# EasyEDA Pro project MIoTEvBoard_A.epro, board PCB
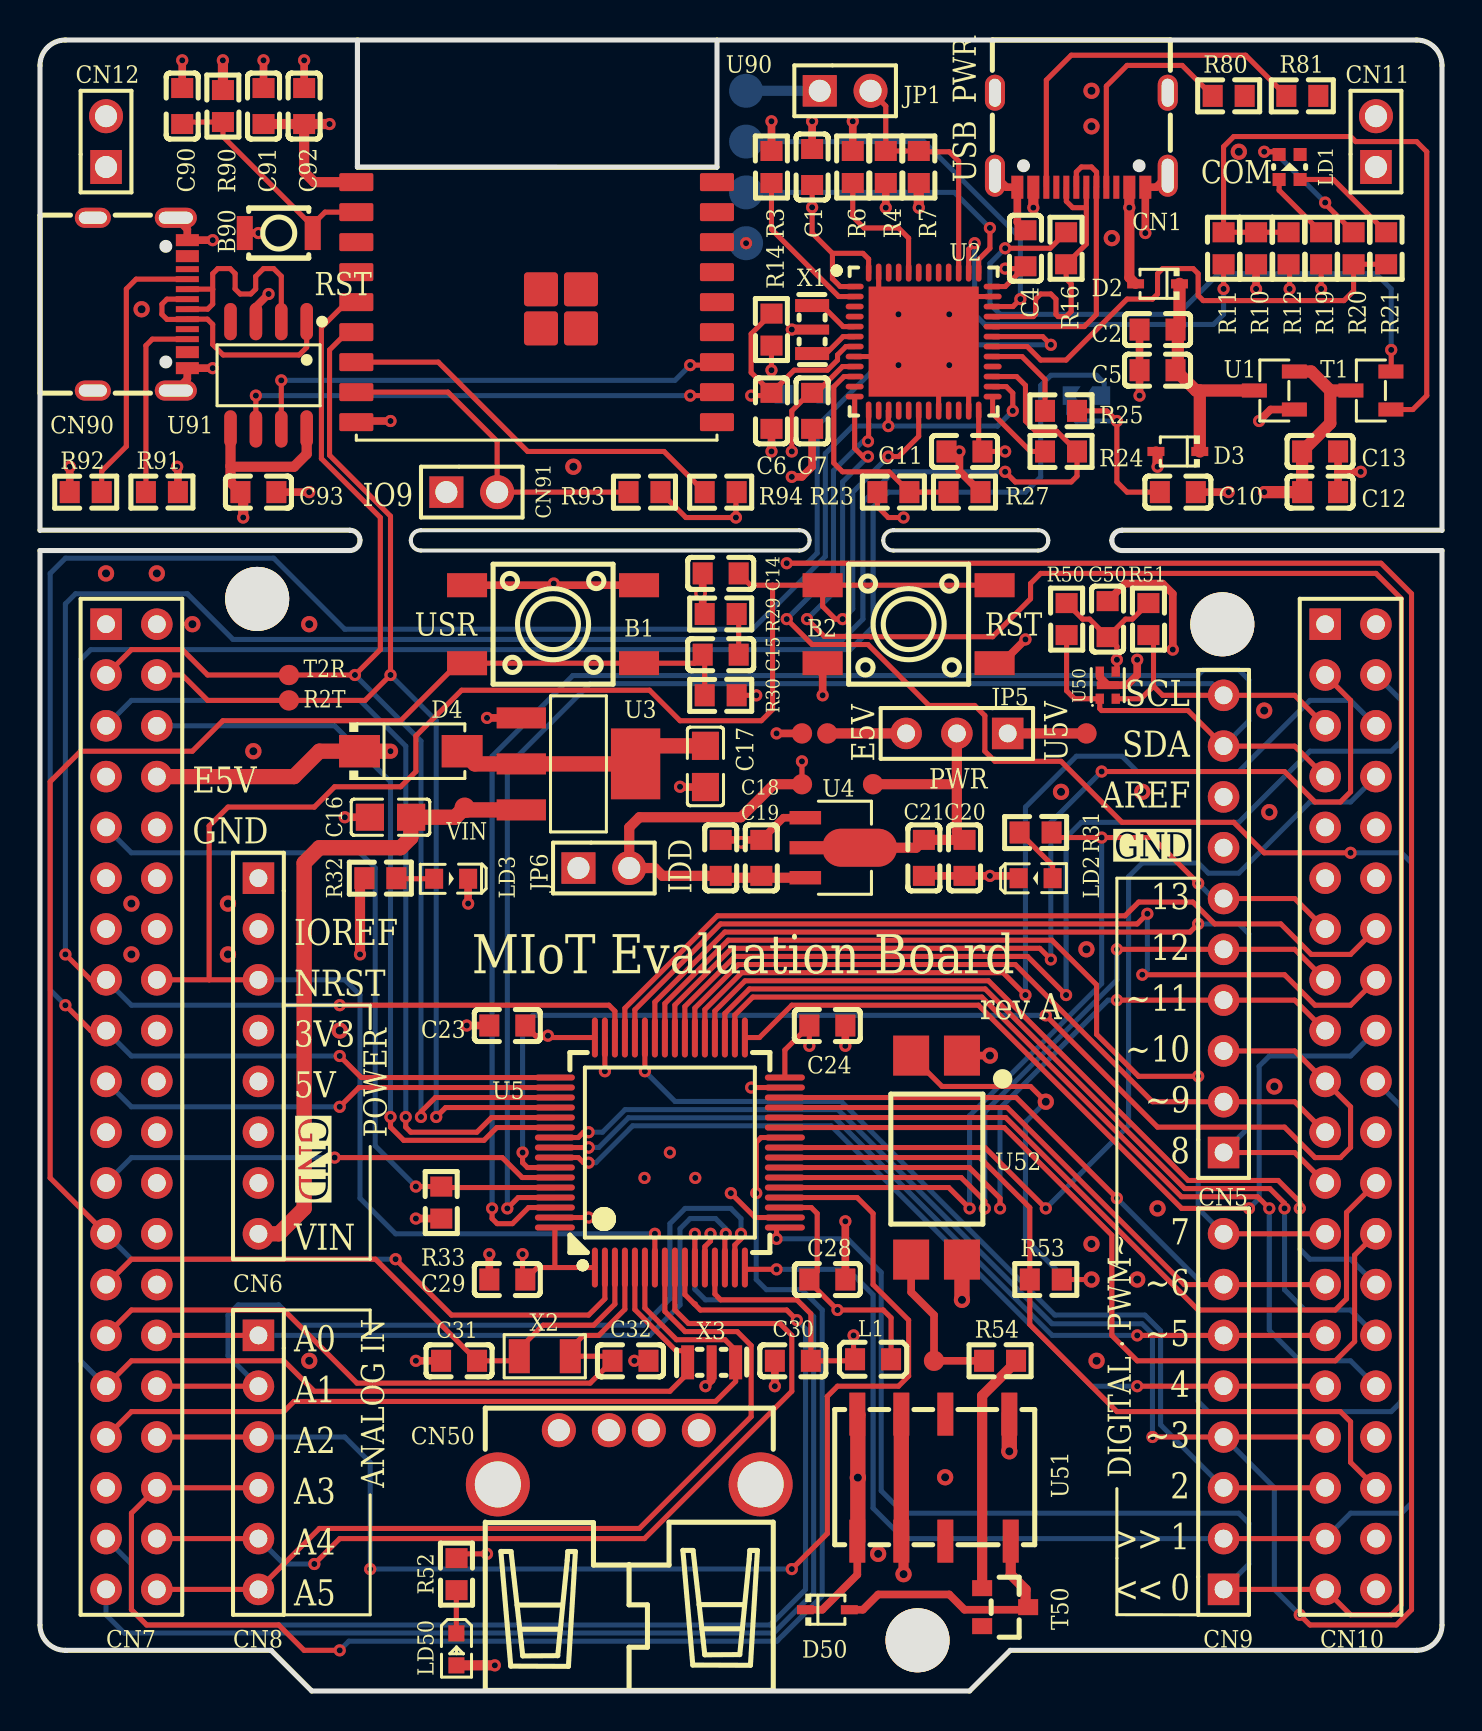
[diagram p5: board, top side]
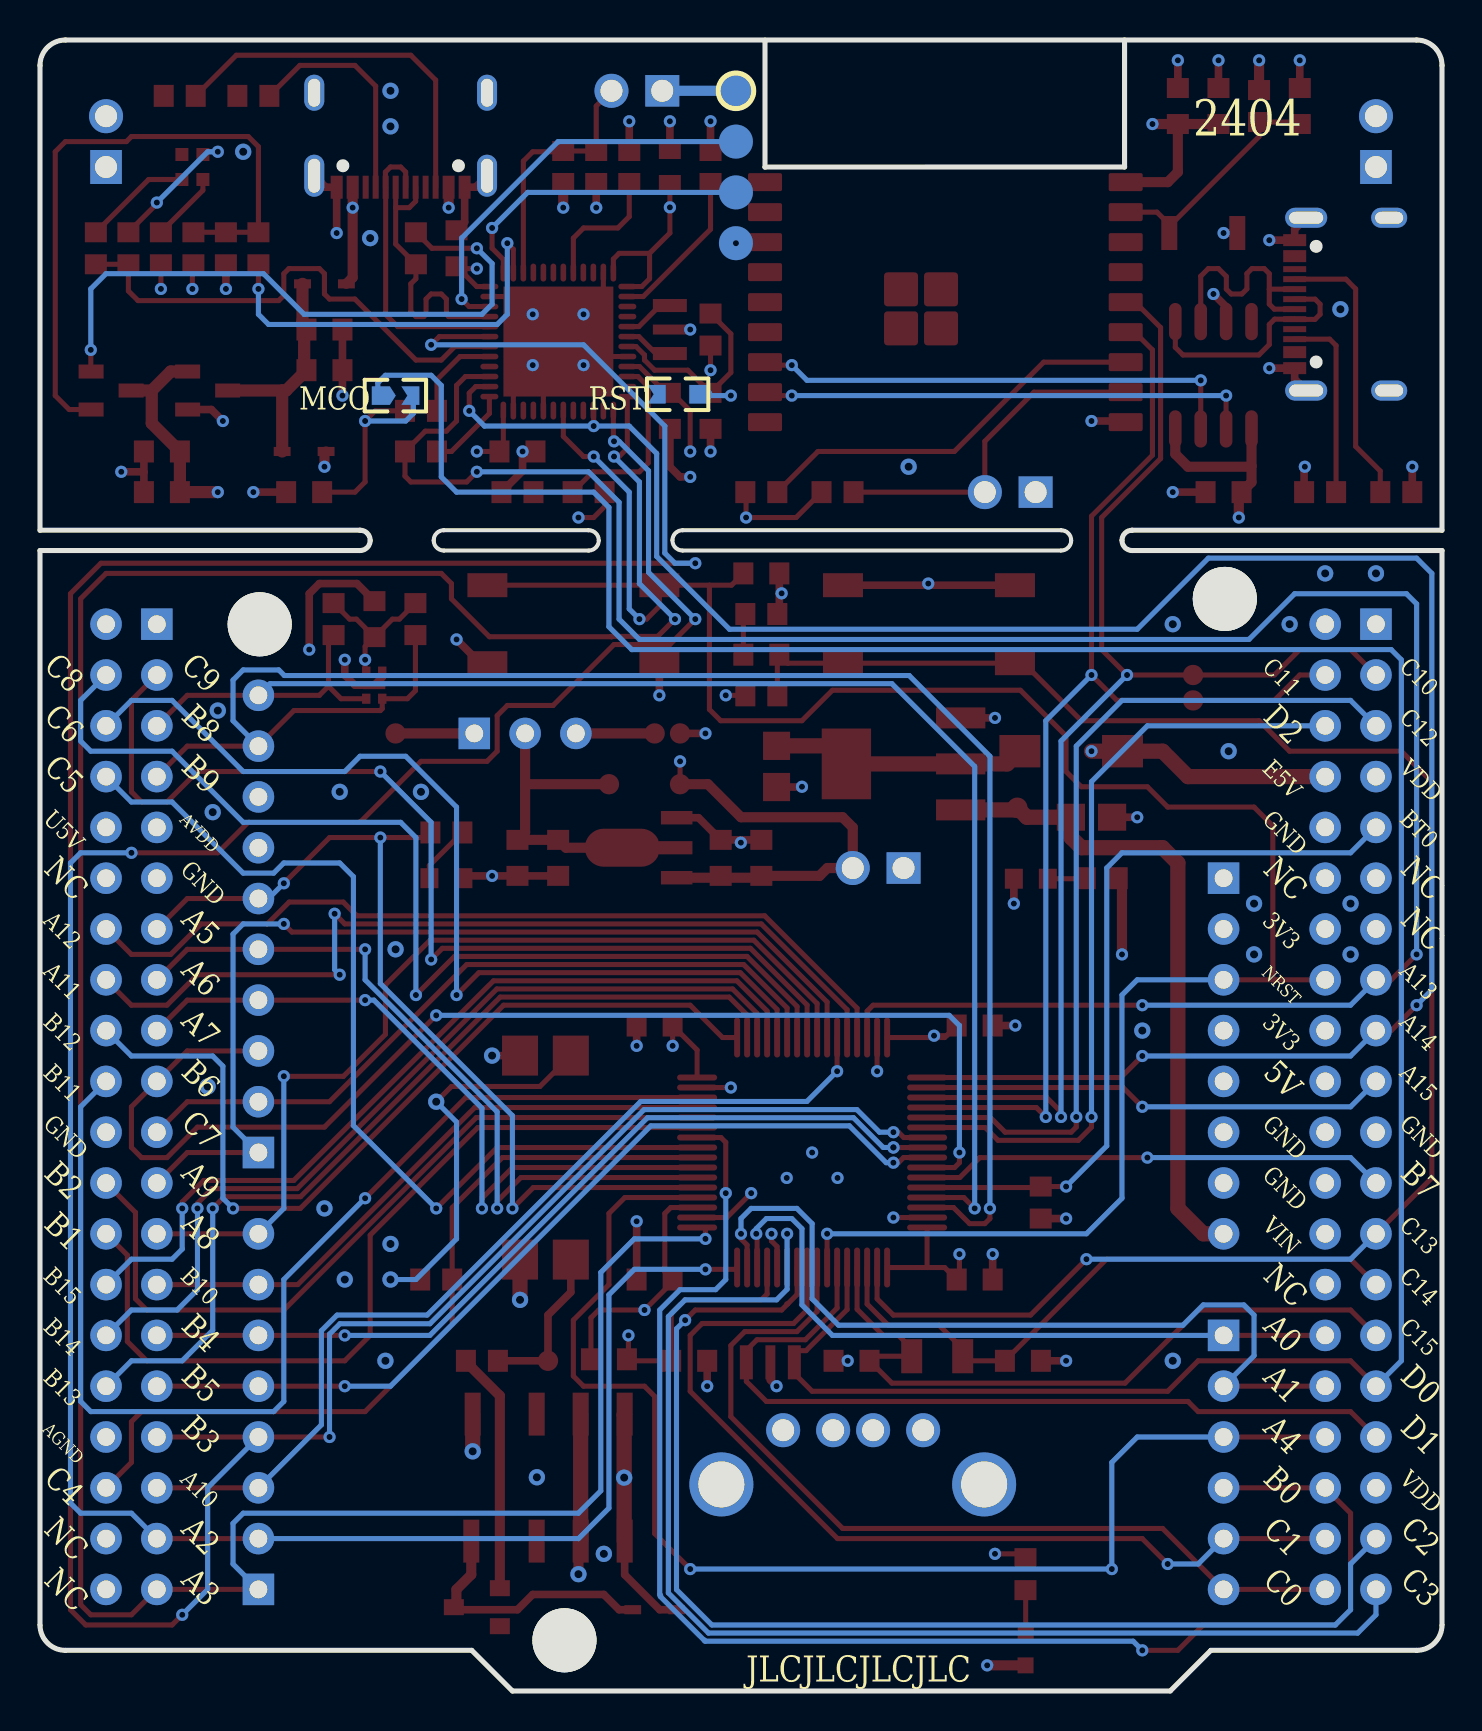
[diagram p6: board, bottom side, seen from below]

Outline 70.1 x 82.55 mm; copper layers: Top Layer, Inner1, Inner2, Bottom Layer. Coordinates in mm from the lower left corner of the outline.
Outline path: 15.87,82.55 15.87,76.2 33.85,76.2 33.85,82.55 ; 0,81.28 0,58.04 15.49,58.04 arc(15.85,57.89) 16,57.53 arc(15.85,57.17) 15.49,57.02 0,57.02 0,3.3 arc(0.37,2.4) 1.27,2.03 11.56,2.03 13.59,0 46.48,0 48.51,2.03 68.83,2.03 arc(69.73,2.4) 70.1,3.3 70.1,57.02 54.1,57.02 arc(53.74,57.17) 53.59,57.53 arc(53.74,57.89) 54.1,58.04 70.1,58.04 70.1,81.28 arc(69.73,82.18) 68.83,82.55 1.27,82.55 arc(0.37,82.18) 0,81.28 ; 18.54,57.53 arc(18.69,57.89) 19.05,58.04 37.97,58.04 arc(38.33,57.89) 38.48,57.53 arc(38.33,57.17) 37.97,57.02 19.05,57.02 arc(18.69,57.17) 18.54,57.53 ; 42.16,57.53 arc(42.31,57.89) 42.67,58.04 49.91,58.04 arc(50.27,57.89) 50.42,57.53 arc(50.27,57.17) 49.91,57.02 42.67,57.02 arc(42.31,57.17) 42.16,57.53
Stack: Top Layer 0.035mm 外层铜厚1oz / Dielectric1 0.2104mm 7628 RC49% 8.6mil / Inner1 0.0152mm 内层铜厚 / Dielectric2 1.065mm 1.1mm H/HOZ 含铜 / Inner2 0.0152mm 内层铜厚 / Dielectric3 0.2104mm 7628 RC49% 8.6mil / Bottom Layer 0.035mm 外层铜厚1oz

## Design rules (mm)
spacing Default (default): track to track 0.152, other pairs 0 to 0.152
track width Default (default): min 0.152, default 0.152, max 25.4
differential pair differentialPair (default): width min 0.127, default 0.254, max 2.54; gap min 0.152, default 0.152
via Default (default): diameter min 0.61, default 0.61, max 100.025; hole min 0.305, default 0.305, max 59.995

## Placement (name value [footprint] x y rotation side)
B1  USER  [KEY-SMD_4P-L6.0-W6.0-P3.90-LS9.0]  25.65 53.34 0 top
B2  RESET  [KEY-SMD_4P-L6.0-W6.0-P3.90-LS9.0]  43.43 53.34 180 top
B90  B3U-1000P  [KEY-SMD_B3U-1000PM]  11.94 72.9 0 top
C1  100nF  [C0603]  38.61 76.2 270 top
C2  1uF  [C0603]  55.88 68.07 0 top
C4  100nF  [C0603]  49.28 72.14 270 top
C5  100nF  [C0603]  55.88 66.04 0 top
C6  100nF  [C0603]  36.58 64.01 90 top
C7  100nF  [C0603]  38.61 64.01 90 top
C10  20pF  [C0603]  56.9 59.94 180 top
C11  100nF  [C0603]  46.23 61.98 0 top
C12  100nF  [C0603]  64.01 59.94 180 top
C13  1uF  [C0603]  64.01 61.98 180 top
C14  100nF  [C0603]  34.04 55.88 0 top
C15  100nF  [C0603]  34.04 51.82 180 top
C16  10uF  [C0805]  17.53 43.69 0 top
C17  10uF  [C0805]  33.27 46.23 90 top
C18  1uF  [C0603]  34.04 41.66 90 top
C19  100nF  [C0603]  36.07 41.66 90 top
C20  100nF  [C0603]  46.23 41.66 270 top
C21  1uF  [C0603]  44.2 41.66 270 top
C23  100nF  [C0603]  23.37 33.27 180 top
C24  100nF  [C0603]  39.37 33.27 0 top
C28  100nF  [C0603]  39.37 20.57 0 top
C29  1uF  [C0603]  23.37 20.57 0 top
C30  100nF  [C0603]  37.64 16.51 180 top
C31  10pF  [C0603]  20.95 16.51 180 top
C32  10pF  [C0603]  29.52 16.51 0 top
C50  100nF  [C0603]  53.38 53.59 270 top
C90  1uF  [C0603]  7.11 79.25 90 top
C91  100nF  [C0603]  11.18 79.25 270 top
C92  1uF  [C0603]  13.21 79.25 90 top
C93  100nF  [C0603]  10.92 59.94 180 top
CN0  SWD  [烧录点4P-2.54MM]  35.31 80.01 270 bottom
CN1  TYPE-C16PIN  [USB-C-SMD_TYPE-C16PIN]  52.07 77.55 180 top
CN5  HDR-F-2.54_1x10  [HDR-F-2.54_1X10]  59.18 38.35 90 top
CN6  HDR-F-2.54_1x8  [HDR-F-2.54_1X8]  10.92 33.02 270 top
CN7  HDR-M-2.54_2x20  [HDR-M-2.54_2X20]  4.57 29.21 270 top
CN8  HDR-F-2.54_1x6  [HDR-F-2.54_1X6]  10.92 12.7 270 top
CN9  HDR-F-2.54_1x8  [HDR-F-2.54_1X8]  59.18 12.7 90 top
CN10  HDR-M-2.54_2x20  [HDR-M-2.54_2X20]  65.53 29.21 270 top
CN11  HDR-M-2.54_1x2  [HDR-M-2.54_1X2]  66.8 77.47 90 top
CN12  HDR-M-2.54_1x2  [HDR-M-2.54_1X2]  3.3 77.47 90 top
CN50  AF 90° WJDG  [USB-A-TH_AF-WJDG]  29.46 11.68 0 top
CN90  TYPE-C16PIN  [USB-C-SMD_TYPE-C16PIN]  5 69.34 270 top
CN91  HDR-M-2.54_1x2  [HDR-M-2.54_1X2]  21.59 59.94 0 top
D2  BAT60JFILM  [SOD-323_L1.8-W1.3-LS2.5-RD]  55.88 70.36 180 top
D3  BAT60JFILM  [SOD-323_L1.8-W1.3-LS2.5-RD]  56.9 61.98 180 top
D4  STPS2L30A  [SMA_L4.4-W2.8-LS5.4-RD]  18.54 46.99 0 top
D50  BAT60JFILM  [SOD-323_L1.8-W1.3-LS2.5-RD]  39.37 4.06 0 top
JP1  HDR-M-2.54_1x2  [HDR-M-2.54_1X2]  40.26 80.01 0 top
JP5  HDR-M-2.54_1x3  [HDR-M-2.54_1X3]  45.85 47.88 180 top
JP6  HDR-M-2.54_1x2  [HDR-M-2.54_1X2]  28.19 41.15 0 top
L1  Bead  [L0603]  41.66 16.59 180 top
LD1  MHT194CRCGCT  [LED-ARRAY-SMD_4P-0605-L1.60-W1.50-BL]  62.48 76.2 270 top
LD2  GREEN  [LED0603_GREEN]  49.78 40.64 180 top
LD3  RED  [LED0603_RED]  20.56 40.61 0 top
LD50  -  [LED_0603]  20.83 2.03 270 top
NOREF  -  [Pad_ie4139]  59.12 53.34 90 top
NOREF#2  -  [Pad_ie4140]  43.88 2.53 90 top
NOREF#3  -  [Pad_ie4141]  10.86 54.61 90 top
R3  10K  [R0603]  36.58 76.2 90 top
R4  4K7  [R0603]  42.29 76.2 270 top
R6  100K  [R0603]  40.64 76.2 90 top
R7  2K7  [R0603]  43.94 76.2 270 top
R10  36K  [R0603]  60.81 72.14 90 top
R11  100R  [R0603]  59.18 72.14 90 top
R12  10K  [R0603]  62.43 72.14 270 top
R14  100K  [R0603]  36.58 68.07 90 top
R16  1K5  [R0603]  51.31 72.14 90 top
R19  0  [R0603]  64.06 72.14 270 top
R20  200R  [R0603]  65.68 72.14 90 top
R21  200R  [R0603]  67.31 72.14 90 top
R23  4K7  [R0603]  42.67 59.94 0 top
R24  100R  [R0603]  51.05 61.98 0 top
R25  100R  [R0603]  51.05 64.01 0 top
R27  4K7  [R0603]  46.23 59.94 180 top
R29  100R  [R0603]  34.04 53.85 0 top
R30  4K7  [R0603]  34.04 49.78 180 top
R31  510R  [R0603]  49.78 42.93 180 top
R32  1K  [R0603]  17.02 40.64 0 top
R33  10K  [R0603]  20.07 24.42 90 top
R50  4K7  [R0603]  51.33 53.59 270 top
R51  4K7  [R0603]  55.42 53.59 270 top
R52  10K  [R0603]  20.83 5.84 90 top
R53  1K  [R0603]  50.29 20.57 0 top
R54  1K  [R0603]  48.01 16.51 0 top
R80  5K1  [R0603]  59.44 79.76 0 top
R81  5K1  [R0603]  63.12 79.76 0 top
R90  10K  [R0603]  9.15 79.25 90 top
R91  5K1  [R0603]  6.1 59.94 0 top
R92  5K1  [R0603]  2.29 59.94 180 top
R93  10K  [R0603]  30.23 59.94 180 top
R94  10K  [R0603]  34.04 59.94 180 top
SB11  ShortPad  [SOLDERJUMPER_2_OPEN_0603]  38.23 64.84 90 bottom
SB16  ShortPad  [SOLDERJUMPER_2_OPEN_0603]  52.32 64.77 270 bottom
T1  S9013  [SOT-23-3_L2.9-W1.3-P1.90-LS2.4-BR]  66.55 65.02 0 top
T50  -  [S8050_SOT-23]  48.26 4.32 180 top
TP1  -  [TP-Round-1.0]  12.45 49.53 0 top
TP2  -  [TP-Round-1.0]  12.45 50.8 0 top
TP3  -  [TP-Round-1.0]  44.7 16.51 0 top
TP4  -  [TP-Round-1.0]  21.24 44.17 0 top
TP5  -  [TP-Round-1.0]  39.37 47.88 0 top
TP6  -  [TP-Round-1.0]  52.32 47.88 0 top
TP7  -  [TP-Round-1.0]  41.66 45.34 0 top
TP8  -  [TP-Round-1.0]  38.1 45.34 0 top
TP9  -  [TP-Round-1.0]  38.1 47.88 0 top
U1  XC6206  [SOT-23-3_L2.9-W1.3-P1.90-LS2.4-BR]  61.72 65.02 0 top
U2  STM32F103CBU6  [UFQFPN-48_L7.0-W7.0-P0.50-BL-EP]  44.19 67.47 270 top
U3  AMS1117-5.0  [SOT-223_L6.5-W3.5-P2.30-LS7.0-BR]  26.92 46.36 180 top
U4  HT7333-A  [SOT-89-3_L4.5-W2.5-P1.50-LS4.2-BR]  39.62 42.16 180 top
U5  STM32F103RxTx  [LQFP-64_L10.0-W10.0-P0.50-LS12.0-BL]  31.5 26.92 0 top
U50  SHT40-AD1B-R2  [DFN-4_L1.5-W1.5-P0.8-TL-EP]  53.39 50.29 90 top
U51  HFD4/5-SR  [RELAY-SMD_HFD4-5-SR]  44.7 10.67 180 top
U52  GX817C-S  [SOP-4_L6.5-W4.6-P2.54-LS10.2-TR]  44.83 26.67 0 top
U90  -  [MHCWB6G-B]  25.15 69.39 0 top
U91  CH340N  [SOP-8_L4.9-W3.9-P1.27-LS6.0-BL]  11.43 65.79 180 top
X1  8MHz  [OSC-SMD_3P-L3.2-W1.3-P1.2-L]  38.61 68.07 90 top
X2  32768  [OSC-SMD_L3.2-W1.5]  25.24 16.74 180 top
X3  8MHz  [OSC-SMD_3P-L3.2-W1.3-P1.2-L]  33.58 16.43 180 top

## Footprints (pads in the part's own frame, mm; a bottom-side part is the same pattern mirrored in y, then rotated)
C0603
  rect 1x1.1 smd: 1(-0.9,0) 2(0.9,0)
C0805
  rect 1.41x1.35 smd: 1(-1.03,0) 2(1.03,0)
DFN-4_L1.5-W1.5-P0.8-TL-EP
  rect 0.505x0.42 smd: 1(-0.677,0.4) 2(-0.677,-0.4) 3(0.677,-0.4) 4(0.677,0.4)
  rect 0.4x1.1 smd: 5(0,0)
HDR-F-2.54_1X6
  rect 1.575x1.575 hole 0.889: 1(-5.08,0)
  round 1.575 hole 0.889: 2(-2.54,0) 3(0,0) 4(2.54,0) 5(5.08,0) 6(7.62,0)
HDR-F-2.54_1X8
  rect 1.575x1.575 hole 0.889: 1(-7.62,0)
  round 1.575 hole 0.889: 2(-5.08,0) 3(-2.54,0) 4(0,0) 5(2.54,0) 6(5.08,0) 7(7.62,0) 8(10.16,0)
HDR-F-2.54_1X10
  rect 1.575x1.575 hole 0.889: 1(-11.43,0)
  round 1.575 hole 0.889: 2(-8.89,0) 3(-6.35,0) 4(-3.81,0) 5(-1.27,0) 6(1.27,0) 7(3.81,0) 8(6.35,0) 9(8.89,0) 10(11.43,0)
HDR-M-2.54_1X2
  rect 1.7x1.575 hole 1.1: 1(-1.27,0)
  round 1.7 hole 1.1: 2(1.27,0)
HDR-M-2.54_1X3
  rect 1.575x1.575 hole 0.889: 1(-2.54,0)
  round 1.575 hole 0.889: 2(0,0) 3(2.54,0)
HDR-M-2.54_2X20
  rect 1.575x1.575 hole 0.889: 1(-24.13,-1.27)
  round 1.575 hole 0.889: 2(-24.13,1.27) 3(-21.59,-1.27) 4(-21.59,1.27) 5(-19.05,-1.27) 6(-19.05,1.27) 7(-16.51,-1.27) 8(-16.51,1.27) 9(-13.97,-1.27) 10(-13.97,1.27) 11(-11.43,-1.27) 12(-11.43,1.27) 13(-8.89,-1.27) 14(-8.89,1.27) 15(-6.35,-1.27) 16(-6.35,1.27) 17(-3.81,-1.27) 18(-3.81,1.27) 19(-1.27,-1.27) 20(-1.27,1.27) 21(1.27,-1.27) 22(1.27,1.27) 23(3.81,-1.27) 24(3.81,1.27) 25(6.35,-1.27) 26(6.35,1.27) 27(8.89,-1.27) 28(8.89,1.27) 29(11.43,-1.27) 30(11.43,1.27) 31(13.97,-1.27) 32(13.97,1.27) 33(16.51,-1.27) 34(16.51,1.27) 35(19.05,-1.27) 36(19.05,1.27) 37(21.59,-1.27) 38(21.59,1.27) 39(24.13,-1.27) 40(24.13,1.27)
KEY-SMD_4P-L6.0-W6.0-P3.90-LS9.0
  rect 2x1.2 smd: 1(-4.3,1.95) 2(4.3,1.95) 3(-4.3,-1.95) 4(4.3,-1.95)
KEY-SMD_B3U-1000PM
  rect 0.8x1.7 smd: 1(-1.7,0) 2(1.7,0)
L0603
  rect 1x1.1 smd: 1(-0.9,0) 2(0.9,0)
LED0603_GREEN
  rect 0.9x1 smd: 1(-0.85,0) 2(0.85,0)
LED0603_RED
  rect 0.9x1 smd: 1(-0.85,0) 2(0.85,0)
LED-ARRAY-SMD_4P-0605-L1.60-W1.50-BL
  rect 0.65x0.65 smd: 1(-0.625,-0.525) 2(-0.625,0.525) 3(0.625,0.525) 4(0.625,-0.525)
LED_0603
  rect 0.8x0.8 smd: 1(-0.851,-0.01) 2(0.75,-0.005)
LQFP-64_L10.0-W10.0-P0.50-LS12.0-BL
  oval 0.3x2 smd: 1(-3.75,-5.75) 2(-3.25,-5.75) 3(-2.75,-5.75) 4(-2.25,-5.75) 5(-1.75,-5.75) 6(-1.25,-5.75) 7(-0.75,-5.75) 8(-0.25,-5.75) 9(0.25,-5.75) 10(0.75,-5.75) 11(1.25,-5.75) 12(1.75,-5.75) 13(2.25,-5.75) 14(2.75,-5.75) 15(3.25,-5.75) 16(3.75,-5.75) 33(3.75,5.75) 34(3.25,5.75) 35(2.75,5.75) 36(2.25,5.75) 37(1.75,5.75) 38(1.25,5.75) 39(0.75,5.75) 40(0.25,5.75) 41(-0.25,5.75) 42(-0.75,5.75) 43(-1.25,5.75) 44(-1.75,5.75) 45(-2.25,5.75) 46(-2.75,5.75) 47(-3.25,5.75) 48(-3.75,5.75)
  oval 2x0.3 smd: 17(5.75,-3.75) 18(5.75,-3.25) 19(5.75,-2.75) 20(5.75,-2.25) 21(5.75,-1.75) 22(5.75,-1.25) 23(5.75,-0.75) 24(5.75,-0.25) 25(5.75,0.25) 26(5.75,0.75) 27(5.75,1.25) 28(5.75,1.75) 29(5.75,2.25) 30(5.75,2.75) 31(5.75,3.25) 32(5.75,3.75) 49(-5.75,3.75) 50(-5.75,3.25) 51(-5.75,2.75) 52(-5.75,2.25) 53(-5.75,1.75) 54(-5.75,1.25) 55(-5.75,0.75) 56(-5.75,0.25) 57(-5.75,-0.25) 58(-5.75,-0.75) 59(-5.75,-1.25) 60(-5.75,-1.75) 61(-5.75,-2.25) 62(-5.75,-2.75) 63(-5.75,-3.25) 64(-5.75,-3.75)
MHCWB6G-B
  rrect 1.7x0.9 smd: 1(-9.329,6.051) 2(-9.329,4.551) 3(-9.329,3.05) 4(-9.329,1.55) 5(-9.329,0.051) 6(-9.329,-1.45) 7(-9.329,-2.95) 8(-9.329,-4.449) 9(-9.329,-5.949) 10(8.704,-5.949) 11(8.704,-4.449) 12(8.704,-2.95) 13(8.704,-1.45) 14(8.704,0.051) 15(8.704,1.55) 16(8.704,3.05) 17(8.704,4.551) 18(8.704,6.051)
  rrect 1.7x1.7 smd: 19(-0.096,0.691) 19(-0.096,-1.262) 19(1.905,0.691) 19(1.905,-1.262)
OSC-SMD_3P-L3.2-W1.3-P1.2-L
  rect 0.65x1.7 smd: 1(-1.2,0) 3(1.2,0)
  rect 0.5x1.7 smd: 2(0,0)
OSC-SMD_L3.2-W1.5
  rect 1.05x1.7 smd: 1(-1.275,0) 2(1.275,0)
Pad_ie4139
  round 3.2 hole 3.2: 0(0,0)
Pad_ie4140
  round 3.2 hole 3.2: 0(0,0)
Pad_ie4141
  round 3.2 hole 3.2: 0(0,0)
R0603
  rect 1x1.1 smd: 1(-0.8,0) 2(0.8,0)
RELAY-SMD_HFD4-5-SR
  rect 0.8x2.15 smd: 1(-3.764,-3.175) 2(-0.565,-3.175) 3(1.635,-3.175) 4(3.836,-3.175) 5(3.836,3.175) 6(1.635,3.175) 7(-0.565,3.175) 8(-3.836,3.175)
S8050_SOT-23
  rect 1x0.8 smd: 1(1.15,-0.823) 2(1.15,1.077) 3(-1.15,0.127)
SMA_L4.4-W2.8-LS5.4-RD
  rect 2.046x1.62 smd: 1(-2.566,0) 2(2.566,0)
SOD-323_L1.8-W1.3-LS2.5-RD
  rect 0.845x0.455 smd: 1(-1.097,0) 2(1.097,0)
SOLDERJUMPER_2_OPEN_0603
  custom 0.93x0.9 smd: 1(0,0.889)
  custom 0.93x1.2 smd: 2(0,-0.889)
SOP-4_L6.5-W4.6-P2.54-LS10.2-TR
  rect 1.8x2 smd: 1(1.27,5.1) 2(-1.27,5.1) 3(-1.27,-5.1) 4(1.27,-5.1)
SOP-8_L4.9-W3.9-P1.27-LS6.0-BL
  oval 0.63x1.865 smd: 1(-1.905,-2.683) 2(-0.635,-2.683) 3(0.635,-2.683) 4(1.905,-2.683) 5(1.905,2.683) 6(0.635,2.683) 7(-0.635,2.683) 8(-1.905,2.683)
SOT-23-3_L2.9-W1.3-P1.90-LS2.4-BR
  rect 1.25x0.7 smd: 1(1,-0.95) 2(1,0.95) 3(-1,0)
SOT-89-3_L4.5-W2.5-P1.50-LS4.2-BR
  rect 1.575x0.672 smd: 1(1.356,-1.5) 3(1.356,1.5)
  custom 5.377x1.9 smd: 2(-1.356,0)
SOT-223_L6.5-W3.5-P2.30-LS7.0-BR
  rect 2.465x1.05 smd: 1(2.857,-2.3) 2(2.857,0) 3(2.857,2.3)
  rect 2.465x3.54 smd: 4(-2.857,0)
TP-Round-1.0
  round 1.016 smd: 1(0,0)
UFQFPN-48_L7.0-W7.0-P0.50-BL-EP
  oval 0.28x0.9 smd: 1(-2.751,-3.45) 2(-2.251,-3.45) 3(-1.75,-3.45) 4(-1.25,-3.45) 5(-0.749,-3.45) 6(-0.249,-3.45) 7(0.249,-3.45) 8(0.75,-3.45) 9(1.25,-3.45) 10(1.75,-3.45) 11(2.251,-3.45) 12(2.751,-3.45) 25(2.751,3.449) 26(2.251,3.449) 27(1.75,3.449) 28(1.25,3.449) 29(0.75,3.449) 30(0.249,3.449) 31(-0.249,3.449) 32(-0.749,3.449) 33(-1.25,3.449) 34(-1.75,3.449) 35(-2.251,3.449) 36(-2.751,3.449)
  oval 0.9x0.28 smd: 13(3.45,-2.751) 14(3.45,-2.251) 15(3.45,-1.75) 16(3.45,-1.25) 17(3.45,-0.75) 18(3.45,-0.249) 19(3.45,0.249) 20(3.45,0.749) 21(3.45,1.25) 22(3.45,1.75) 23(3.45,2.251) 24(3.45,2.751) 37(-3.449,2.751) 38(-3.449,2.251) 39(-3.449,1.75) 40(-3.449,1.25) 41(-3.449,0.749) 42(-3.449,0.249) 43(-3.449,-0.249) 44(-3.449,-0.75) 45(-3.449,-1.25) 46(-3.449,-1.75) 47(-3.449,-2.251) 48(-3.449,-2.751)
  rect 5.5x5.5 smd: 49(0,0)
USB-A-TH_AF-WJDG
  round 1.7 hole 1.1: 1(-3.521,1.355) 2(-1.018,1.355) 3(0.981,1.355) 4(3.48,1.355)
  round 3.2 hole 2.3: 5(-6.57,-1.355) 5(6.57,-1.355)
USB-C-SMD_TYPE-C16PIN
  oval 1x2.1 hole 0.6x1.7: 1(-4.32,1.788) 2(4.32,1.788)
  oval 1x1.8 hole 0.6x1.4: 3(-4.32,-2.362) 4(4.32,-2.362)
  rect 0.6x1.15 smd: A1B12(-3.2,2.362) A4B9(-2.4,2.362) B1A12(3.2,2.362) B4A9(2.4,2.362)
  rect 0.3x1.15 smd: A5(-1.25,2.362) A6(-0.25,2.362) A7(0.25,2.362) A8(-1.75,2.362) B5(1.75,2.362) B6(0.75,2.362) B7(-0.75,2.362) B8(1.25,2.362)
烧录点4P-2.54MM
  round 1.7 smd: 1(0,0) 2(2.54,0) 3(5.08,0) 4(7.62,0)

## Nets
As in the schematic.

Pads without a net: CN1 A8 B8; CN6 1; CN7 1 2 11 12 13 28; CN10 1 2 12 38 40; CN50 2 3; CN90 A4B9 A8 B4A9 B8; NOREF 0; NOREF#2 0; NOREF#3 0; U2 3 4 11 14 16 17 19 21 22 28 40 41 42 43 45 46; U51 2 7; U90 3 4 10 13 14 15 16 17 18; U91 4

## Via types
v1: diameter 0.61, hole 0.305, Top Layer to Bottom Layer, 175 vias
v2: diameter 0.813, hole 0.406, Top Layer to Bottom Layer, 36 vias

## Routing (per net, layer and track width the routed paths; a pad name or vN(x,y) marks a point on that pad's centre or on a via; arc(x,y) is an arc through that point)
+3V3: length 93
  Top Layer w0.254: R23.1 41.87,59.22 42.42,58.67 v1(43.18,58.67) ; v1(38.1,46.48) TP8.1
  Top Layer w0.508: 36.16,40.66 C19.1 ; 36.16,40.66 34.13,40.66 C18.1 31.13,40.76 30.73,41.15 JP6.2 29.46,43.18 29.97,43.69 35.05,43.69 36.7,45.34 TP8.1 ; 36.16,40.66 U4.3
  Inner1 w0.254: v1(43.18,58.67) 50.29,58.67 51.05,57.91 51.05,52.58 49.78,51.31 39.12,51.31 38.1,50.29 v1(38.1,46.48)
  Inner1 w0.508: CN7.14 CN6.2
  Inner1 w0.762: 12.95,38.1 CN6.2 ; 12.95,38.1 28.19,38.1 29.46,39.37 JP6.2 ; 12.95,38.1 12.95,33.78 12.19,33.02 CN6.4
  Inner1 w1.27: CN7.18 CN6.4
+3V3_LINK: length 38.2
  Top Layer w0.254: R14.1 v1(36.58,66.04) ; U2.9 40.13,66.22 38.81,64.91 C7.2 38.49,64.91 37.59,64.01 v1(37.59,61.98) ; R19.2 v1(64.06,70.1) ; C1.2 v1(38.61,74.18) 38.61,72.9 39.62,71.88 ; v1(48.26,61.98) C11.2 46.94,62.17 U2.24 ; v1(48.26,71.12) 49.16,71.12 ; 49.16,71.12 48.26,70.22 47.63,70.22 ; 49.16,71.12 C4.2 ; 39.62,71.88 41.15,71.88 41.43,71.6 41.43,70.92 ; 39.62,71.88 39.62,70.61 40.01,70.22 40.74,70.22
  Top Layer w0.61: 64.52,65.02 T1.3 ; 64.52,65.02 64.52,63.38 C13.2 C12.2 v1(61.21,59.94) ; 64.52,65.02 63.57,65.97 U1.2
  Inner1 w0.254: v1(38.61,74.18) 38.61,74.17
  Bottom Layer w0.508: CN0.1 38.99,80.01
+5V: length 125.2
  Top Layer w0.381: D50.1 39.12,4.06 40.87,5.82 U51.5
  Top Layer w0.508: 40.89,7.52 U51.5 ; 45.85,45.26 45.85,42.94 C20.1 C21.1 43.8,42.16 U4.2 ; 45.85,45.26 JP5.2 ; 45.85,45.26 45.77,45.34 TP7.1 ; R32.1 16,40.42 v1(16,36.83)
  Top Layer w0.762: 40.89,7.52 v2(40.89,10.67) 40.89,13.82 U51.4 ; v2(48.47,11.98) U51.1 ; U52.4 v2(46.1,19.56)
  Inner1 w0.762: v2(46.1,19.56) 43.22,19.56 43.18,19.59 ; 43.18,19.59 43.18,12.95 ; 43.18,19.59 43.18,36.83 ; 43.18,12.95 44.15,11.98 v2(48.47,11.98) ; 43.18,12.95 v2(40.89,10.67) ; JP5.2 45.85,39.5 43.18,36.83 ; 43.18,36.83 v1(16,36.83) 16,31.5 14.99,30.48 CN6.5
  Inner1 w1.27: CN7.20 CN6.5
AVDD: length 81.1
  Top Layer w0.254: 40.68,16.51 C30.1 38.54,18.86 37.85,19.56 34.04,19.56 33.75,19.85 U5.13 ; 40.68,16.51 v1(40.68,17.78) ; 40.68,16.51 L1.2
  Inner1 w0.254: CN10.9 60.71,43.18 CN5.8 56.64,42.16 56.64,9.4 55.63,8.38 40.64,8.38 39.62,9.4 39.62,16.72 v1(40.68,17.78)
GND: length 134.6
  Top Layer w0.254: U2.49 46.44,69.72 U2.35 ; U2.49 44.93,66.72 ; U2.49 43.44,66.72 U2.8 ; U2.49 41.93,69.72 41.93,70.92 ; 44.93,66.72 46.44,65.22 U2.23 ; 44.93,66.72 U2.20 ; U5.31 v1(35.56,30.17) ; R52.2 21.04,6.86 v1(22.35,6.86) ; U5.18 35.76,23.67 v1(34.54,24.89) ; U5.12 33.25,22.22 33.53,22.5 v1(33.53,22.86) ; U5.47 v1(28.25,30.99) ; U5.63 v1(27.43,23.67)
  Top Layer w0.381: B1.1 25.69,55.29 ; 25.69,55.29 B1.2 ; 25.69,55.29 v1(25.69,55.37) ; 6.79,65.02 7.37,65.6 CN90.B1A12 v1(8.64,66.14) ; C24.2 v1(40.27,32.26) ; C10.1 v1(59.44,59.94) ; C31.2 v1(18.8,16.51) ; TP9.1 v1(36.83,47.88) ; R29.1 33.14,53.95 33.14,54.88 ; v1(32,45.21) 32,45.2 C17.1 ; v1(11.43,69.85) 10.8,69.22 U91.3 ; 64.91,60.94 64.93,60.96 v1(66.04,60.96) ; 64.91,60.94 C12.1 ; 64.91,60.94 C13.1 ; R92.2 v1(1.49,61.21) ; X1.2 v1(37.59,68.07) ; C1.1 v1(38.61,78.49) ; LD3.2 v1(21.41,39.37) ; 35.06,42.56 v1(35.06,42.42) ; 35.06,42.56 C19.2 37.18,43.66 U4.1 ; 35.06,42.56 C18.2 ; v1(6.86,61.21) 6.9,61.21 R91.2 ; v1(54.98,64.77) C5.1 C2.1 ; R27.1 45.97,61 v1(45.97,61.98) C11.1 ; B90.1 v1(10.92,72.9) ; U3.1 v1(22.35,48.66) ; R10.1 v1(60.81,70.1) ; C50.1 54.26,55.37 56.13,55.37 56.64,54.86 v1(56.64,52.07) ; v1(37.59,60.71) 38.1,60.71 38.61,61.21 C7.1 ; v1(49.28,52.58) 48.09,51.39 B2.1 ; C16.1 v1(15.24,43.69) ; v1(17.53,63.5) 15.87,63.5 U90.9 ; C90.2 v1(7.11,81.53) ; C29.1 v1(22.47,21.84) ; B2.2 v1(39.13,49.78) ; v1(54.86,51.56) 54.86,50.8 54.36,50.29 U50.5 52.99,50.69 U50.4 ; C93.1 v1(13.46,59.94) ; v1(60.96,63.5) 61.53,64.07 U1.1 ; C23.2 v1(21.34,33.27) ; v1(8.64,72.54) CN90.A1B12 7.37,73.09 6.79,73.66 ; C32.2 v1(29.72,16.51) ; R4.2 v1(42.29,74.17) ; v1(55.27,72.9) CN1.A1B12 55.82,75.19 CN1.1 ; R6.2 v1(40.64,78.49) ; C30.2 v1(36.74,15.24) ; R3.2 v1(36.58,78.49) ; v1(40.27,23.48) C28.2 ; C21.2 C20.2 v1(47.5,40.76) 48.82,40.76 LD2.2 ; X3.2 33.58,15.55 v1(33.27,15.24) ; 33.14,54.88 C14.1 ; 33.14,54.88 v1(33.02,54.88) ; R33.1 v1(18.8,23.62) ; C4.1 48.87,73.44 CN1.B1A12 48.33,75.19 CN1.2 ; C91.1 11.18,81.53 ; C6.1 v1(36.58,61.98) ; C92.2 v1(13.21,81.53)
  vias: v1(11.18,81.53) v1(30.23,25.65) v1(31.5,26.92) v1(32.77,25.65) v1(35.31,72.39) v1(42.93,68.83) v1(42.93,66.29) v1(45.47,68.83) v1(45.47,66.29) v2(3.3,55.88) v2(4.57,39.37) v2(4.57,36.83) v2(5.08,69.09) v2(5.84,55.88) v2(7.62,53.34) v2(9.4,39.37) v2(9.4,36.83) v2(10.67,46.99) v2(13.46,53.34) v2(13.46,16.51) v2(14.99,33.02) v2(26.67,61.21) v2(41.91,6.86) v2(45.26,10.69) v2(51.05,44.96) v2(52.32,37.08) v2(52.58,80.01) v2(52.58,78.23) v2(52.58,22.35) v2(52.83,16.51) v2(53.59,72.64) v2(54.86,20.57) v2(55.12,44.96) v2(55.88,24.13) v2(59.94,76.96) v2(61.21,49.02) v2(61.47,43.94) v2(61.72,30.23)
VDD: length 63.9
  Top Layer w0.254: U5.32 37.25,32.05 C24.1 v1(38.47,32.26) ; v1(24.13,21.84) 24.13,20.71 C29.2 24.87,21.17 25.74,21.17 ; v1(25.4,32.77) 24.78,32.77 ; 24.78,32.77 24.87,32.67 U5.48 ; 24.78,32.77 C23.1 ; R50.1 52.13,53.59 52.48,53.59 C50.2 ; 25.74,21.17 25.75,21.18 U5.64 ; 25.74,21.17 U5.1 ; C50.2 53.03,52.69 ; C50.2 54.28,53.59 54.62,53.59 R51.1 55.08,54.39 ; C50.2 53.85,52.23 v1(53.85,51.56) 53.85,51.03 U50.3 ; R93.1 32.3,58.67 v1(34.8,58.67) 34.8,59.91 R94.1 ; v1(35.81,49.78) R30.1 ; U5.19 38.56,24.17 38.86,23.88 38.86,20.97 C28.1 38.47,20.46 v1(39.88,19.05) 42.16,19.05 42.56,18.66 L1.1
  Top Layer w0.381: U52.1 v2(47.5,31.77)
  Top Layer w0.508: U90.1 13.71,75.44 13.21,75.95 C92.1 ; R90.2 9.15,81.53 v1(9.14,81.53) ; 9.53,61.25 9.53,60.44 C93.2 10.16,59.81 v1(10.16,58.67) ; 9.53,61.25 9.56,61.21 12.7,61.21 13.34,61.85 U91.8 ; 9.53,61.25 U91.5 ; C92.1 v1(14.48,78.35) ; C92.1 C91.2
VIN: length 37.8
  Top Layer w0.762: U3.3 21.35,44.06 TP4.1 20.76,43.69 C16.2 18.54,43.67 18.54,42.67 18.03,42.16 13.97,42.16 13.21,41.4 13.21,24.13 11.94,22.86 CN6.8
  Inner1 w1.27: CN7.26 CN6.8
AIN_1: length 11.4
  Top Layer w0.254: U2.10 40.2,65.72 39.69,65.21 39.69,61.4 40.13,60.96 42.46,60.96 R23.2 R27.2
BOOT0: length 38
  Top Layer w0.254: U5.60 20.11,25.17 R33.2 v1(18.8,25.22)
  Bottom Layer w0.254: CN7.9 4.57,41.91 16,41.91 16.76,41.15 16.76,27.25 v1(18.8,25.22)
CC11: length 11.4
  Top Layer w0.254: R80.1 57.11,81.28 54.36,81.28 53.32,80.24 CN1.A5
CC12: length 18.7
  Top Layer w0.254: CN1.B5 50.32,80.55 51.56,81.79 60.29,81.79 R81.1
CC21: length 13.9
  Top Layer w0.254: R92.1 3.09,61 4.32,62.23 4.32,70.1 4.81,70.59 CN90.A5
CC22: length 9.5
  Top Layer w0.254: R91.1 5.3,67.27 5.62,67.59 CN90.B5
DBG_DN: length 12
  Top Layer w0.254: U91.2 12.07,70.74 11.68,71.12 11.18,71.12 10.78,70.73 10.78,70.1 10.54,69.85 10.01,69.85 9.76,70.1 9.76,70.87 9.51,71.12 8.89,71.12 8.64,70.87 8.64,70.09 ; 8.64,70.09 CN90.B7 ; 8.64,70.09 8.64,69.34 8.39,69.09 CN90.A7
DBG_DP: length 12
  Top Layer w0.254: CN90.A6 6.35,69.59 6.1,69.34 6.1,68.83 6.35,68.58 7.35,68.58 CN90.B6 8.37,68.59 8.64,68.33 8.64,67.32 9.16,66.8 12.95,66.8 13.34,67.18 U91.1
DRXI: length 24.8
  Top Layer w0.254: U91.6 v1(10.8,64.77) ; v1(32.51,64.77) 33.68,64.77 U90.11
  Bottom Layer w0.254: v1(10.8,64.77) v1(32.51,64.77)
DTXO: length 24.6
  Top Layer w0.254: U91.7 v1(12.07,65.53) ; U90.12 33.27,66.44 33.13,66.29 v1(32.51,66.29)
  Bottom Layer w0.254: v1(12.07,65.53) 31.75,65.53 v1(32.51,66.29)
E5V: length 91.6
  Top Layer w0.508: D3.2 55.88,61.89 v1(55.88,61.21) ; v1(43.94,74.17) R7.2 ; JP5.3 TP5.1
  Top Layer w0.762: v1(17.53,46.99) D4.1 13.97,46.99 12.7,45.72 CN7.8
  Inner1 w0.508: 51.82,60.2 52.83,61.21 v1(55.88,61.21) ; 51.82,60.2 45.72,60.2 43.94,61.98 v1(43.94,74.17) ; 51.82,60.2 51.59,59.97 51.59,51.59 50.29,50.29 44.2,50.29 43.31,49.4 JP5.3 43.31,46.36 41.91,44.96 35.81,44.96 33.78,46.99 v1(17.53,46.99)
LED_LINK: length 25.3
  Top Layer w0.254: U2.30 49.36,67.22 50.04,66.55 51.31,66.55 54.36,69.6 55.63,69.6 55.88,69.85 55.88,70.87 56.13,71.12 57.66,71.12 57.91,70.87 57.91,69.77 58.17,69.52 65.2,69.52 65.68,70 R20.1 R21.1
LINK_RX: length 127.5
  Top Layer w0.254: v1(41.4,62.48) 41.43,62.52 U2.13 ; U5.16 35.34,21.08 v1(36.83,21.08) ; v1(65.53,41.91) 61.21,41.91 59.69,43.43 54.1,43.43 51.05,46.48 47.75,46.48 47.24,46.99 47.24,48.77 46.74,49.28 44.45,49.28 41.4,52.32 38.61,52.32 v1(37.34,53.59) ; CN10.37 CN9.2
  Bottom Layer w0.254: CN9.2 43.18,7.62 41.66,9.14 41.66,19.81 40.39,21.08 v1(36.83,21.08) ; v1(41.4,62.48) 41.15,62.48 39.67,61.01 39.67,55.93 v1(37.34,53.59) ; CN10.37 65.53,8.89 68.07,8.89 68.58,9.4 68.58,41.4 68.07,41.91 v1(65.53,41.91)
LINK_TX: length 145.8
  Top Layer w0.254: 41.52,52.71 41.5,52.73 39.22,52.73 v1(38.35,53.59) ; 41.52,52.71 47.63,52.71 49.53,54.61 49.53,55.37 50.04,55.88 66.8,55.88 68.07,54.61 68.07,4.32 67.56,3.81 65.53,3.81 CN10.39 CN9.1 ; 41.52,52.71 41.57,52.73 ; U2.12 40.74,62.13 41.15,61.72 v1(41.4,61.72) ; v1(36.83,22.61) 36.83,23.11 36.89,23.17 U5.17
  Bottom Layer w0.254: v1(41.4,61.72) 40.13,60.45 40.13,55.37 v1(38.35,53.59) ; v1(36.83,22.61) 40.39,22.61 42.06,20.93 42.06,10.01 43.18,8.89 59.94,8.89 60.45,8.38 60.45,6.35 CN9.1
MCO: length 138.2
  Top Layer w0.254: U5.5 29.75,19.07 31.8,17.02 32.38,17.02 X3.3 32.38,15.87 31.5,14.99 13.72,14.99 12.19,16.51 4.57,16.51 CN7.31
  Bottom Layer w0.254: CN7.31 2.03,16.51 2.03,51.56 2.54,52.07 40.51,52.07 41.66,53.21 41.66,59.18 42.42,59.94 49.28,59.94 50.04,60.71 50.04,65.28 50.55,65.79 52.83,65.79 53.21,65.41 SB16.2
MEN: length 12
  Top Layer w0.254: C90.1 7.21,78.45 R90.1 9.15,77.72 13.64,73.23 ; 13.64,73.23 13.64,73.33 14.25,73.94 U90.2 ; 13.64,73.23 B90.2
MIO8: length 20.1
  Top Layer w0.254: U90.7 19.92,66.44 24.38,61.98 31.2,61.98 R94.2
MIO9: length 17.2
  Top Layer w0.254: U90.8 20.4,64.94 22.86,62.48 CN91.2 R93.2
MRXI: length 65.6
  Top Layer w0.254: U90.5 15.34,69.44 14.07,68.17 14.07,61.62 17.02,58.67 17.02,52.07 v1(15.75,50.8) TP2.1 8.38,50.8 7.11,52.07 4.57,52.07 CN7.3 ; v1(19.05,28.7) 19.05,28.96 19.77,29.67 U5.51
  Bottom Layer w0.254: v1(19.05,28.7) 19.05,47.5 v1(15.75,50.8)
MTXO: length 61.1
  Top Layer w0.254: v1(19.81,28.7) 20.28,29.17 U5.52 ; U90.6 15.37,67.94 14.48,67.06 14.48,61.79 17.53,58.74 v1(17.53,50.8) 16.26,49.53 TP1.1 8.38,49.53 7.11,50.8 CN7.4
  Bottom Layer w0.254: v1(19.81,28.7) 19.81,48.51 v1(17.53,50.8)
NRST: length 112.3
  Top Layer w0.254: 8.46,35.56 8.46,43.26 9.4,44.2 13.72,44.2 14.73,45.21 18.03,45.21 18.8,45.97 18.8,47.75 21.08,50.04 30.48,50.04 32,48.51 36.07,48.51 36.63,49.08 36.63,55.29 ; 8.46,35.56 CN7.16 ; 8.46,35.56 CN6.3 ; v1(42.42,61.72) 42.93,61.72 43.94,62.73 U2.18 ; B2.4 39.13,54.23 39.77,53.59 v1(40.13,53.59) ; B2.4 36.63,55.29 ; B2.4 B2.3 ; C14.2 35.53,55.29 36.63,55.29 ; U5.7 v1(30.75,22.86)
  Bottom Layer w0.254: v1(42.42,61.72) 40.64,59.94 40.64,54.1 v1(40.13,53.59) ; CN6.3 15.24,35.56 16,34.8 16,24.64 17.78,22.86 v1(30.75,22.86)
OSC_IN: length 2.6
  Top Layer w0.254: X1.3 39.11,69.27 40.16,68.22 40.74,68.22
OSC_OUT: length 2.5
  Top Layer w0.254: U2.6 40.16,67.72 39.31,66.87 X1.1
PA0: length 35.3
  Top Layer w0.254: v1(34.29,22.86) 34.25,22.82 U5.14 ; CN7.30 CN8.1
  Bottom Layer w0.254: CN8.1 30.48,17.78 32,19.3 32,23.11 32.51,23.62 33.78,23.62 34.29,23.11 v1(34.29,22.86)
PA1: length 43
  Top Layer w0.254: U5.15 34.75,22.3 35.05,22.61 v1(35.05,22.86) ; CN7.32 CN8.2
  Bottom Layer w0.254: v1(35.05,22.86) 35.05,23.62 34.54,24.13 32.26,24.13 31.5,23.37 31.5,19.61 30.17,18.29 12.95,18.29 11.94,19.3 9.91,19.3 9.4,18.8 9.4,16.76 CN8.2
PA4: length 65.1
  Top Layer w0.254: CN7.34 CN8.3 ; U5.20 40.86,24.67 41.66,23.88 41.66,20.32 43.43,18.54 43.43,15.75 42.93,15.24 39.88,15.24 39.37,14.73 39.37,7.87 v1(37.59,6.1)
  Bottom Layer w0.254: v1(37.59,6.1) v1(16.51,6.1) 16.51,11.43 15.24,12.7 CN8.3
PA5: length 46.6
  Top Layer w0.254: CN10.13 62.74,39.62 CN5.6 ; v1(46.48,24.13) 45.44,25.17 U5.21 ; R31.1 50.84,42.67 v1(53.09,42.67) 55.63,42.67 v1(57.91,40.39)
  Bottom Layer w0.254: CN5.6 58.67,39.62 v1(57.91,40.39) ; v1(53.09,42.67) 53.09,35.37 46.48,28.77 v1(46.48,24.13)
PA6: length 37.6
  Top Layer w0.254: v1(47.24,24.13) 47.24,24.49 46.06,25.67 U5.22 ; v1(53.85,37.08) CN5.5 62.74,37.08 CN10.15
  Bottom Layer w0.254: v1(47.24,24.13) 47.24,28.96 53.85,35.56 v1(53.85,37.08)
PA7: length 36
  Top Layer w0.254: v1(48.01,24.13) 48.01,24.64 46.47,26.17 U5.23 ; CN10.17 62.74,34.54 CN5.4 v1(53.85,34.54)
  Bottom Layer w0.254: v1(53.85,34.54) 53.41,34.54 48.01,29.14 v1(48.01,24.13)
PA8: length 47.4
  Top Layer w0.254: CN9.8 CN10.25 ; U5.41 31.25,34.37 34.41,37.54 50.6,37.54 52.83,35.31 52.83,32.83 54.93,30.73 57.91,30.73 v1(57.91,30.74)
  Bottom Layer w0.254: v1(57.91,30.74) 57.91,24.13 CN9.8
PA9: length 50.5
  Top Layer w0.254: v1(57.91,38.35) 57.51,37.95 34.25,37.95 30.75,34.45 U5.42 ; CN5.1 62.74,26.92 CN10.23
  Bottom Layer w0.254: v1(57.91,38.35) 59.94,38.35 60.45,37.85 60.45,28.19 CN5.1
PA10: length 47.1
  Top Layer w0.254: U5.43 v1(30.25,30.99) ; CN9.3 CN10.35
  Bottom Layer w0.254: CN9.3 56.03,13.31 56.03,18.01 55.25,18.8 50.75,18.8 40.06,29.48 31.76,29.48 v1(30.25,30.99)
PA11: length 45
  Top Layer w0.254: CN10.16 65.53,34.29 63.75,34.29 62.23,35.81 v1(55.12,35.81) ; U5.44 29.75,34.06 34.04,38.35 54.86,38.35 v1(55.37,38.86)
  Bottom Layer w0.254: v1(55.37,38.86) 55.37,36.07 v1(55.12,35.81)
PA12: length 42.8
  Top Layer w0.254: U5.45 29.25,34.14 33.87,38.76 54.25,38.76 54.94,39.45 57.65,39.45 58.74,38.35 62.04,38.35 63.57,36.83 65.53,36.83 CN10.14
PA13: length 114.5
  Top Layer w0.254: U2.27 48.83,65.72 49.28,65.28 49.28,63.5 49.78,62.99 50.84,62.99 R24.2 51.85,60.74 51.56,60.45 48.77,60.45 v1(48.26,60.96) ; v1(1.27,36.83) 2.54,35.56 CN7.15 ; U5.46 28.75,33.99 28.45,34.29 v1(14.99,34.29)
  Bottom Layer w0.254: v1(14.99,34.29) 4.57,34.29 CN7.15 ; v1(1.27,36.83) 1.27,54.36 1.78,54.86 7.37,54.86 9.65,52.58 40.13,52.58 41.15,53.59 41.15,59.44 42.67,60.96 v1(48.26,60.96)
PA14: length 108.2
  Top Layer w0.254: CN7.17 2.54,33.02 v1(1.27,34.29) ; v1(48.64,64.01) 48.64,64.9 48.32,65.22 U2.26 ; v1(14.99,31.75) 16.06,30.67 U5.49 ; U2.15 42.42,64.01 v1(42.42,63.25)
  Bottom Layer w0.254: CN7.17 4.57,31.75 v1(14.99,31.75) ; v1(1.27,34.29) 0.51,35.05 0.51,55.88 1.27,56.64 11.68,56.64 15.24,53.09 35.63,53.09 39.27,56.73 39.27,61.87 40.64,63.25 v1(42.42,63.25) 47.88,63.25 v1(48.64,64.01)
PA15: length 23.4
  Top Layer w0.254: v1(14.99,29.21) 15.95,30.17 U5.50
  Bottom Layer w0.254: CN7.19 4.57,29.21 v1(14.99,29.21)
PB0: length 74.9
  Top Layer w0.254: CN8.4 CN7.36 4.57,8.89 4.57,4.06 5.33,3.3 11.94,3.3 13.21,2.03 v1(14.99,2.03) ; v1(35.81,24.89) 35.81,27.43 36.06,27.67 U5.26
  Bottom Layer w0.254: v1(14.99,2.03) 15.44,2.49 36.85,2.49 36.87,2.54 36.9,2.54 39.09,4.73 39.07,4.78 39.12,4.83 39.12,19.05 38.1,20.07 36.32,20.07 35.81,20.57 v1(35.81,24.89)
PB1: length 42.5
  Top Layer w0.254: U5.27 48.21,28.17 53.59,22.79 53.59,17.78 54.86,16.51 64.77,16.51 65.73,17.47 65.73,21.79 CN10.26
PB2: length 38.7
  Top Layer w0.254: CN10.24 65.33,23.93 65.33,19.61 64.77,19.05 57.91,19.05 48.29,28.67 U5.28
PB3: length 172.7
  Top Layer w0.254: v1(62.99,3.81) 63.5,3.3 67.82,3.3 68.58,4.06 68.58,54.86 67.06,56.39 v1(37.34,56.39) ; U2.31 50.14,67.72 v1(50.55,67.31) ; v1(55.63,12.7) CN9.4 CN10.33 ; v1(27.43,27.94) 27.18,27.94 26.91,27.67 U5.55
  Bottom Layer w0.254: v1(27.43,27.94) 28.13,27.94 29.26,29.07 39.9,29.07 50.6,18.36 55.11,18.36 55.63,17.84 v1(55.63,12.7) ; v1(37.34,56.39) 38.35,56.39 38.86,56.9 38.86,63.25 42.93,67.31 v1(50.55,67.31) ; CN9.4 61.72,10.16 61.72,5.08 v1(62.99,3.81)
PB4: length 43.6
  Top Layer w0.254: v1(54.86,17.78) CN9.6 CN10.29 ; U5.56 27.43,27.17 v1(27.43,27.18)
  Bottom Layer w0.254: v1(54.86,17.78) 50.61,17.78 39.73,28.66 29.43,28.66 27.94,27.18 v1(27.43,27.18)
PB5: length 44.8
  Top Layer w0.254: v1(54.86,15.24) CN9.5 CN10.31 ; v1(27.43,26.42) 27.18,26.42 26.92,26.67 U5.57
  Bottom Layer w0.254: v1(27.43,26.42) 27.79,26.42 29.63,28.26 39.56,28.26 52.58,15.24 v1(54.86,15.24)
PB6: length 62.9
  Top Layer w0.254: v1(50.29,33.78) 55.88,28.19 62.23,28.19 63.75,26.67 65.02,26.67 65.53,27.18 65.53,29.21 CN10.19 62.74,32 CN5.3 ; U5.58 24.37,26.17 24.13,26.42 v1(24.13,26.92)
  Bottom Layer w0.254: v1(50.29,33.78) 24.64,33.78 24.13,33.27 v1(24.13,26.92)
PB7: length 23.4
  Top Layer w0.254: v1(14.73,26.67) 23.11,26.67 24.11,25.67 U5.59
  Bottom Layer w0.254: v1(14.73,26.67) 4.57,26.67 CN7.23
PB8: length 76.7
  Top Layer w0.254: R51.2 55.68,52.54 55.68,50.24 ; CN10.5 62.74,49.78 CN5.10 56.13,49.78 55.68,50.24 ; 55.68,50.24 55.05,49.61 U50.2 ; v1(23.37,24.13) 23.91,24.67 U5.61
  Bottom Layer w0.254: v1(23.37,24.13) 23.37,46.23 27.51,50.37 58.6,50.37 CN5.10
PB9: length 88.1
  Top Layer w0.254: v1(22.61,24.13) 22.61,23.62 22.86,23.37 23.62,23.37 24.43,24.17 U5.62 ; CN10.7 62.74,47.24 CN5.9 57.4,49.02 53.09,49.02 52.99,49.12 U50.1 51.73,49.61 51.33,50.01 R50.2
  Bottom Layer w0.254: CN5.9 60.45,48.51 60.45,50.55 59.94,51.05 58.17,51.05 57.89,50.77 26.64,50.77 22.61,46.74 v1(22.61,24.13)
PB10: length 30.7
  Top Layer w0.254: U5.29 48.36,29.17 57.22,20.32 CN9.7 CN10.27
PB11: length 57.6
  Top Layer w0.254: v1(53.85,24.64) 48.81,29.67 U5.30
  Bottom Layer w0.254: CN10.20 68.07,29.21 68.07,14.48 67.56,13.97 58.42,13.97 57.91,14.48 57.91,20.57 v1(53.85,24.64)
PB12: length 44
  Top Layer w0.254: U5.33 35.98,32.67 37.59,34.29 46.92,34.29 57.08,24.13 v1(60.45,24.13)
  Bottom Layer w0.254: v1(60.45,24.13) 60.96,24.64 60.96,31.24 61.47,31.75 65.53,31.75 CN10.18
PB13: length 45.2
  Top Layer w0.254: v1(61.47,24.13) 60.88,24.71 57.07,24.71 47.09,34.7 35.64,34.7 34.75,33.8 U5.34
  Bottom Layer w0.254: CN10.32 65.53,16.51 62.99,16.51 61.47,18.03 v1(61.47,24.13)
PB14: length 44
  Top Layer w0.254: U5.35 34.25,33.88 35.47,35.1 47.26,35.1 57.24,25.12 61.49,25.12 62.23,24.38 v1(62.23,24.13)
  Bottom Layer w0.254: CN10.30 65.53,19.05 63.25,19.05 62.23,20.07 v1(62.23,24.13)
PB15: length 42.7
  Top Layer w0.254: v1(62.99,24.13) 62.99,24.45 61.92,25.53 57.41,25.53 47.43,35.51 35.26,35.51 33.75,34 U5.36
  Bottom Layer w0.254: CN10.28 65.53,21.59 63.5,21.59 62.99,22.1 v1(62.99,24.13)
PC0: length 44.1
  Top Layer w0.254: CN7.40 CN8.6 13.97,8.13 29.97,8.13 35.56,13.72 35.56,17.27 34.86,17.97 32.26,17.97 31.25,18.98 U5.8
PC1: length 47.1
  Top Layer w0.254: CN7.38 CN8.5 ; U5.9 31.75,19.05 32.42,18.38 37,18.38 37.59,17.78 37.59,14.99 30.23,7.62 14.99,7.62 v1(13.72,6.35)
  Bottom Layer w0.254: CN8.5 12.19,6.35 v1(13.72,6.35)
PC2: length 60
  Top Layer w0.254: 32.72,19.36 32.25,19.82 U5.10 ; 32.72,19.36 32.77,19.36 ; 32.72,19.36 33.02,19.05 37.34,19.05 v1(37.85,18.54)
  Bottom Layer w0.254: v1(37.85,18.54) 38.28,18.11 38.28,5.07 36.51,3.3 5.33,3.3 4.57,4.06 4.57,6.35 CN7.37
PC3: length 62.6
  Top Layer w0.254: U5.11 v1(32.75,22.86)
  Bottom Layer w0.254: v1(32.75,22.86) 32.75,20.09 33.27,19.56 37.85,19.56 38.68,18.72 38.68,4.9 36.68,2.9 4.22,2.9 3.3,3.81 CN7.39
PC4: length 41
  Top Layer w0.254: U5.24 46.99,26.67 49.49,24.17 R53.1 49.49,18.33 53.85,13.97 65.02,13.97 65.53,13.46 65.53,11.43 CN10.36
PC5: length 47.5
  Top Layer w0.254: v1(50.29,24.13) 47.25,27.17 U5.25
  Bottom Layer w0.254: v1(50.29,24.13) 54.43,28.27 54.43,40.72 55.12,41.4 57.91,41.4 58.42,40.89 59.94,40.89 63.5,44.45 65.53,44.45 CN10.8
PC6: length 48.9
  Top Layer w0.254: U5.37 33.25,34.08 35.09,35.92 48.16,35.92 v1(49.28,34.8)
  Bottom Layer w0.254: v1(49.28,34.8) 49.28,44.2 51.82,46.74 54.1,46.74 54.86,45.97 59.94,45.97 63.5,49.53 65.53,49.53 CN10.6
PC7: length 37.4
  Top Layer w0.254: CN10.21 62.74,29.46 CN5.2 55.63,29.46 48.77,36.32 34.92,36.32 32.75,34.15 U5.38
PC8: length 52.9
  Top Layer w0.254: v1(51.31,34.8) 49.38,36.73 34.75,36.73 32.25,34.22 U5.39
  Bottom Layer w0.254: CN10.4 68.07,49.53 68.07,47.5 67.56,46.99 63.5,46.99 59.94,43.43 52.07,43.43 51.31,42.67 v1(51.31,34.8)
PC9: length 51.9
  Top Layer w0.254: U5.40 31.75,34.3 34.58,37.14 49.99,37.14 v1(50.55,36.58) ; CN10.3 65.53,49.53 65.53,44.96 65.02,44.45 63.75,44.45 62.23,45.97 v1(53.09,45.97)
  Bottom Layer w0.254: v1(50.55,36.58) 50.55,43.43 v1(53.09,45.97)
PC12: length 43.4
  Top Layer w0.254: U5.53 22.58,28.67 21.84,27.94 18.54,27.94 18.29,28.19 v1(18.29,28.7)
  Bottom Layer w0.254: CN7.5 4.57,49.53 16,49.53 18.29,47.24 v1(18.29,28.7)
PC13: length 89.6
  Top Layer w0.254: R30.2 33.24,51.72 C15.2 32.71,51.39 B1.4 B1.3 20.91,51.39 18.03,48.51 9.14,48.51 7.62,46.99 2.03,46.99 0.51,45.47 0.51,25.65 CN7.25 ; U5.2 28.25,19.61 27.43,18.8 20.57,18.8 v1(17.78,21.59)
  Bottom Layer w0.254: CN7.25 4.57,21.59 v1(17.78,21.59)
PC14: length 31.3
  Top Layer w0.254: CN7.27 4.57,21.59 16.77,21.59 C31.1 23.74,16.51 X2.2 23.96,17.11 25.15,18.29 27.69,18.29 28.75,19.35 U5.3
PC15: length 36
  Top Layer w0.254: U5.4 29.25,19.09 27.94,17.78 27.18,17.78 26.52,17.12 X2.1 28.4,16.74 C32.1 27.51,15.39 15.85,15.39 12.19,19.05 4.57,19.05 CN7.29
PD1: length 41.6
  Top Layer w0.254: U5.6 30.25,19.15 31.83,17.56 34.25,17.56 34.8,17.02 34.8,16.45 X3.1 34.78,15.48 33.78,14.48 12.7,14.48 12.19,13.97 4.57,13.97 CN7.33
PD2: length 38.9
  Top Layer w0.254: U5.54 22.84,28.17 22.2,27.53 18.19,27.53 17.53,28.19 v1(17.53,28.7)
  Bottom Layer w0.254: v1(17.53,28.7) 17.53,45.47 14.73,48.26 CN7.6
PWR_EXT: length 12.8
  Top Layer w0.254: JP1.2 42.29,79.25 R4.1 R7.1 43.98,76.96 45.47,76.96 45.94,76.49 45.94,70.92
STM_JTCK: length 15.4
  Top Layer w0.254: v1(47.5,73.15) 47.5,72.14 46.94,71.57 46.94,70.92
  Bottom Layer w0.254: v1(47.5,73.15) 45.72,74.93 CN0.3
STM_JTMS: length 20.3
  Top Layer w0.254: U2.34 48.65,69.22 v1(49.02,69.6)
  Bottom Layer w0.254: CN0.2 44.2,77.47 49.02,72.64 v1(49.02,69.6)
STM_RST: length 12.9
  Top Layer w0.254: R14.2 35.56,67.86 35.56,65.92 36.46,65.02 ; 36.46,65.02 C6.2 37.71,66.04 39.37,66.04 39.88,66.55 39.88,66.8 40.3,67.22 U2.7 ; 36.46,65.02 36.21,64.77 v1(35.56,64.77)
  Bottom Layer w0.254: SB11.2 37.27,64.77 v1(35.56,64.77)
T_SWDIO_IN: length 4.3
  Top Layer w0.254: U2.25 47.63,63.87 49.53,61.98 R24.1
U5V: length 78.7
  Top Layer w0.254: v1(62.48,70.1) 62.48,71.29 R12.2
  Top Layer w0.508: CN1.A4B9 v1(54.47,74.17) 54.47,70.67 D2.2 ; v1(49.67,74.17) CN1.B4A9 ; TP6.1 JP5.1
  Inner1 w0.508: CN10.10 65.53,44.45 62.48,44.45 60.96,45.97 56.13,45.97 52.58,49.53
  Inner1 w0.762: v1(49.67,74.17) v1(54.47,74.17) 61.47,74.17 62.48,73.15 v1(62.48,70.1) 62.48,59.87 61.72,59.11 53.52,59.11 52.58,58.17 52.58,49.53 50.93,47.88 JP5.1
USB_DN: length 14.5
  Top Layer w0.254: CN1.A7 51.82,75.95 52.07,76.2 52.58,76.2 52.83,75.95 52.83,75.2 CN1.B7 52.82,68.82 52.22,68.22 47.63,68.22
USB_DP: length 14.4
  Top Layer w0.254: CN1.B6 51.32,74.49 51.64,74.17 52.32,74.17 ; 52.32,74.17 52.32,72.35 R16.1 51.31,70.61 51.56,70.36 51.56,68.98 51.31,68.72 50.91,68.72 50.8,68.83 50.8,69.6 50.55,69.85 50.04,69.85 49.78,69.6 49.78,68.83 49.67,68.72 U2.33 ; 52.32,74.17 52.32,74.17 52.32,74.17 CN1.A6
USB_RE: length 20.5
  Top Layer w0.254: 46.44,70.92 46.44,72.09 v1(46.74,72.39) ; v1(59.18,70.1) R11.1
  Bottom Layer w0.254: v1(59.18,70.1) 59.18,68.83 58.67,68.33 47.24,68.33 46.74,68.83 v1(46.74,72.39)
VCTRL: length 42.4
  Top Layer w0.508: U51.6 43.18,7.38 v2(43.18,5.84) ; 20.82,1.28 v1(22.74,1.28)
  Top Layer w0.762: U51.3 U51.6
  Inner1 w0.762: 27.18,4.83 27.18,2.54 25.92,1.28 v1(22.74,1.28) ; 27.18,4.83 25.91,6.1 25.91,13 25.94,13.04 ; 27.18,4.83 42.16,4.83 v2(43.18,5.84)
$1N62: length 2.1
  Top Layer w0.254: C15.1 34.94,53.75 R29.2
$1N103: length 12.8
  Top Layer w0.762: D4.2 21.74,46.36 U3.2 U3.4 30.68,47.26 C17.2
$1N1133: length 1.9
  Top Layer w0.254: LD3.1 17.85,40.61 R32.2
$2N6: length 32.1
  Top Layer w0.254: R16.2 50.51,72.14 v1(48.26,72.14) ; v1(67.56,67.06) 67.56,65.99 T1.2
  Bottom Layer w0.254: v1(48.26,72.14) 47.5,71.37 47.5,69.34 48.01,68.83 56.9,68.83 58.93,70.87 66.8,70.87 67.56,70.1 v1(67.56,67.06)
$2N7: length 32.5
  Top Layer w0.254: R12.1 R10.2 R11.2 59.18,77.22 59.69,77.72 65.53,77.72 65.79,77.47 68.83,77.47 69.34,76.96 69.34,64.77 68.65,64.07 T1.1
$2N18: length 11.6
  Top Layer w0.61: 57.99,65.02 D3.1 ; 57.99,65.02 U1.3 ; 57.99,65.02 57.8,65.02 C5.2 56.9,66.16 56.9,67.82 ; C2.2 56.98,68.27 D2.1
$2N25: length 5.4
  Top Layer w0.254: LD1.3 64.67,75.58 R21.2
$2N26: length 7
  Top Layer w0.254: LD1.1 61.82,76.96 v1(61.21,76.96) ; R20.2 64.26,74.36 v1(64.26,74.42)
  Bottom Layer w0.254: v1(61.21,76.96) 61.72,76.96 v1(64.26,74.42)
$2N27: length 3.5
  Top Layer w0.254: LD1.4 61.96,75.04 R19.1
$2N43: length 7.9
  Top Layer w0.254: U2.2 39.94,69.72 36.58,73.09 R3.1
$2N64: length 4.7
  Top Layer w0.254: U2.29 49.1,66.72 50.25,65.57 R25.1
$2N65: length 11.1
  Top Layer w0.254: R25.2 53.34,64.01 v1(53.85,63.5) 53.85,60.45 54.36,59.94 C10.2
  Bottom Layer w0.254: SB16.1 51.44,63.88 51.82,63.5 v1(53.85,63.5)
$2N80: length 6.6
  Top Layer w0.254: 43.43,70.92 43.43,72.64 42.93,73.15 41.2,73.15 40.64,73.72 R6.1
$3N90: length 3
  Top Layer w0.254: LD2.1 50.63,41.28 R31.2
$5N600: length 2.2
  Top Layer w0.254: R52.1 20.82,5.03 LD50.1
$5N1393: length 20.6
  Top Layer w0.254: R53.2 v2(52.58,20.57) ; v2(50.29,29.46) 49.53,30.23 45.11,30.23 U52.2
  Bottom Layer w0.254: v2(50.29,29.46) 49.28,28.45 49.28,22.61 51.31,20.57 v2(52.58,20.57)
$5N1443: length 8
  Top Layer w0.381: R54.1 TP3.1 44.7,18.8 43.56,19.94 U52.3
$5N1445: length 12.1
  Top Layer w0.508: R54.2 48.81,16.46 47.11,14.76 T50.1
$5N1506: length 13.2
  Top Layer w0.381: D50.2 41.15,4.06 41.91,4.83 45.47,4.83 46.23,4.06 49.03,4.06 49.28,4.32
  Top Layer w0.508: U51.8 48.54,5.82 49.28,5.07 49.28,4.32 T50.3

## Copper pours and planes (outline as drawn; the poured copper is in the pictures)
+3V3_LINK on Inner1: 35.81,82.04 69.34,82.04 69.34,57.91 35.81,57.91
GND on Top Layer: -1.52,85.85 71.88,85.85 71.88,-2.79 -1.52,-2.79
GND on Bottom Layer: -3.05,86.61 74.68,86.61 74.68,-2.54 -3.05,-2.54
GND on Inner2: -1.27,84.33 70.87,84.33 70.87,-1.27 -1.27,-1.27
VDD on Inner1: 0.76,57.15 69.34,57.15 69.34,2.79 0.76,2.79
VDD on Inner1: 0.76,82.04 35.31,82.04 35.31,56.64 0.76,56.64

## Text on the board
Bottom Silkscreen Layer: NRST | AVDD | AGND | C10 | C12 | VDD | BT0 | A13 | A14 | A15 | GND | C13 | C14 | C15 | C11 | E5V | 3V3 | VIN | B10 | A10 | U5V | A12 | A11 | B12 | B11 | B15 | B14 | B13 | NC | B7 | D0 | D1 | C2 | C3 | D2 | 5V | A0 | A1 | A4 | B0 | C1 | C0 | C9 | B8 | B9 | A5 | A6 | A7 | B6 | C7 | A9 | A8 | B4 | B5 | B3 | A2 | A3 | C8 | C6 | C5 | B2 | B1 | C4 | MCO | RST | JLCJLCJLCJLC | 2404
Top Silkscreen Layer: T2R | R2T | VIN | PWR | RST | USR | ANALOG IN | POWER | IDD | E5V | USB  PWR | U5V | DIGITAL · PWM~ | IO9 | COM | GND | IOREF | NRST | 3V3 | 5V | A0 | A1 | A2 | A3 | A4 | A5 | rev A | >> | << | SCL | SDA | 13 | 12 | ~11 | ~10 | 8 | 7 | ~6 | ~5 | 4 | ~3 | 2 | 1 | 0 | AREF | ~9 | MIoT Evaluation Board
